# EasyEDA schematic easyeda.json
TITLE: Capacitive Plant Monitor; REV: 1.4; Date: 2020-01-05; Sheet: 1/1; Drawn By: Maciej Miklas; Company: Maciej Miklas
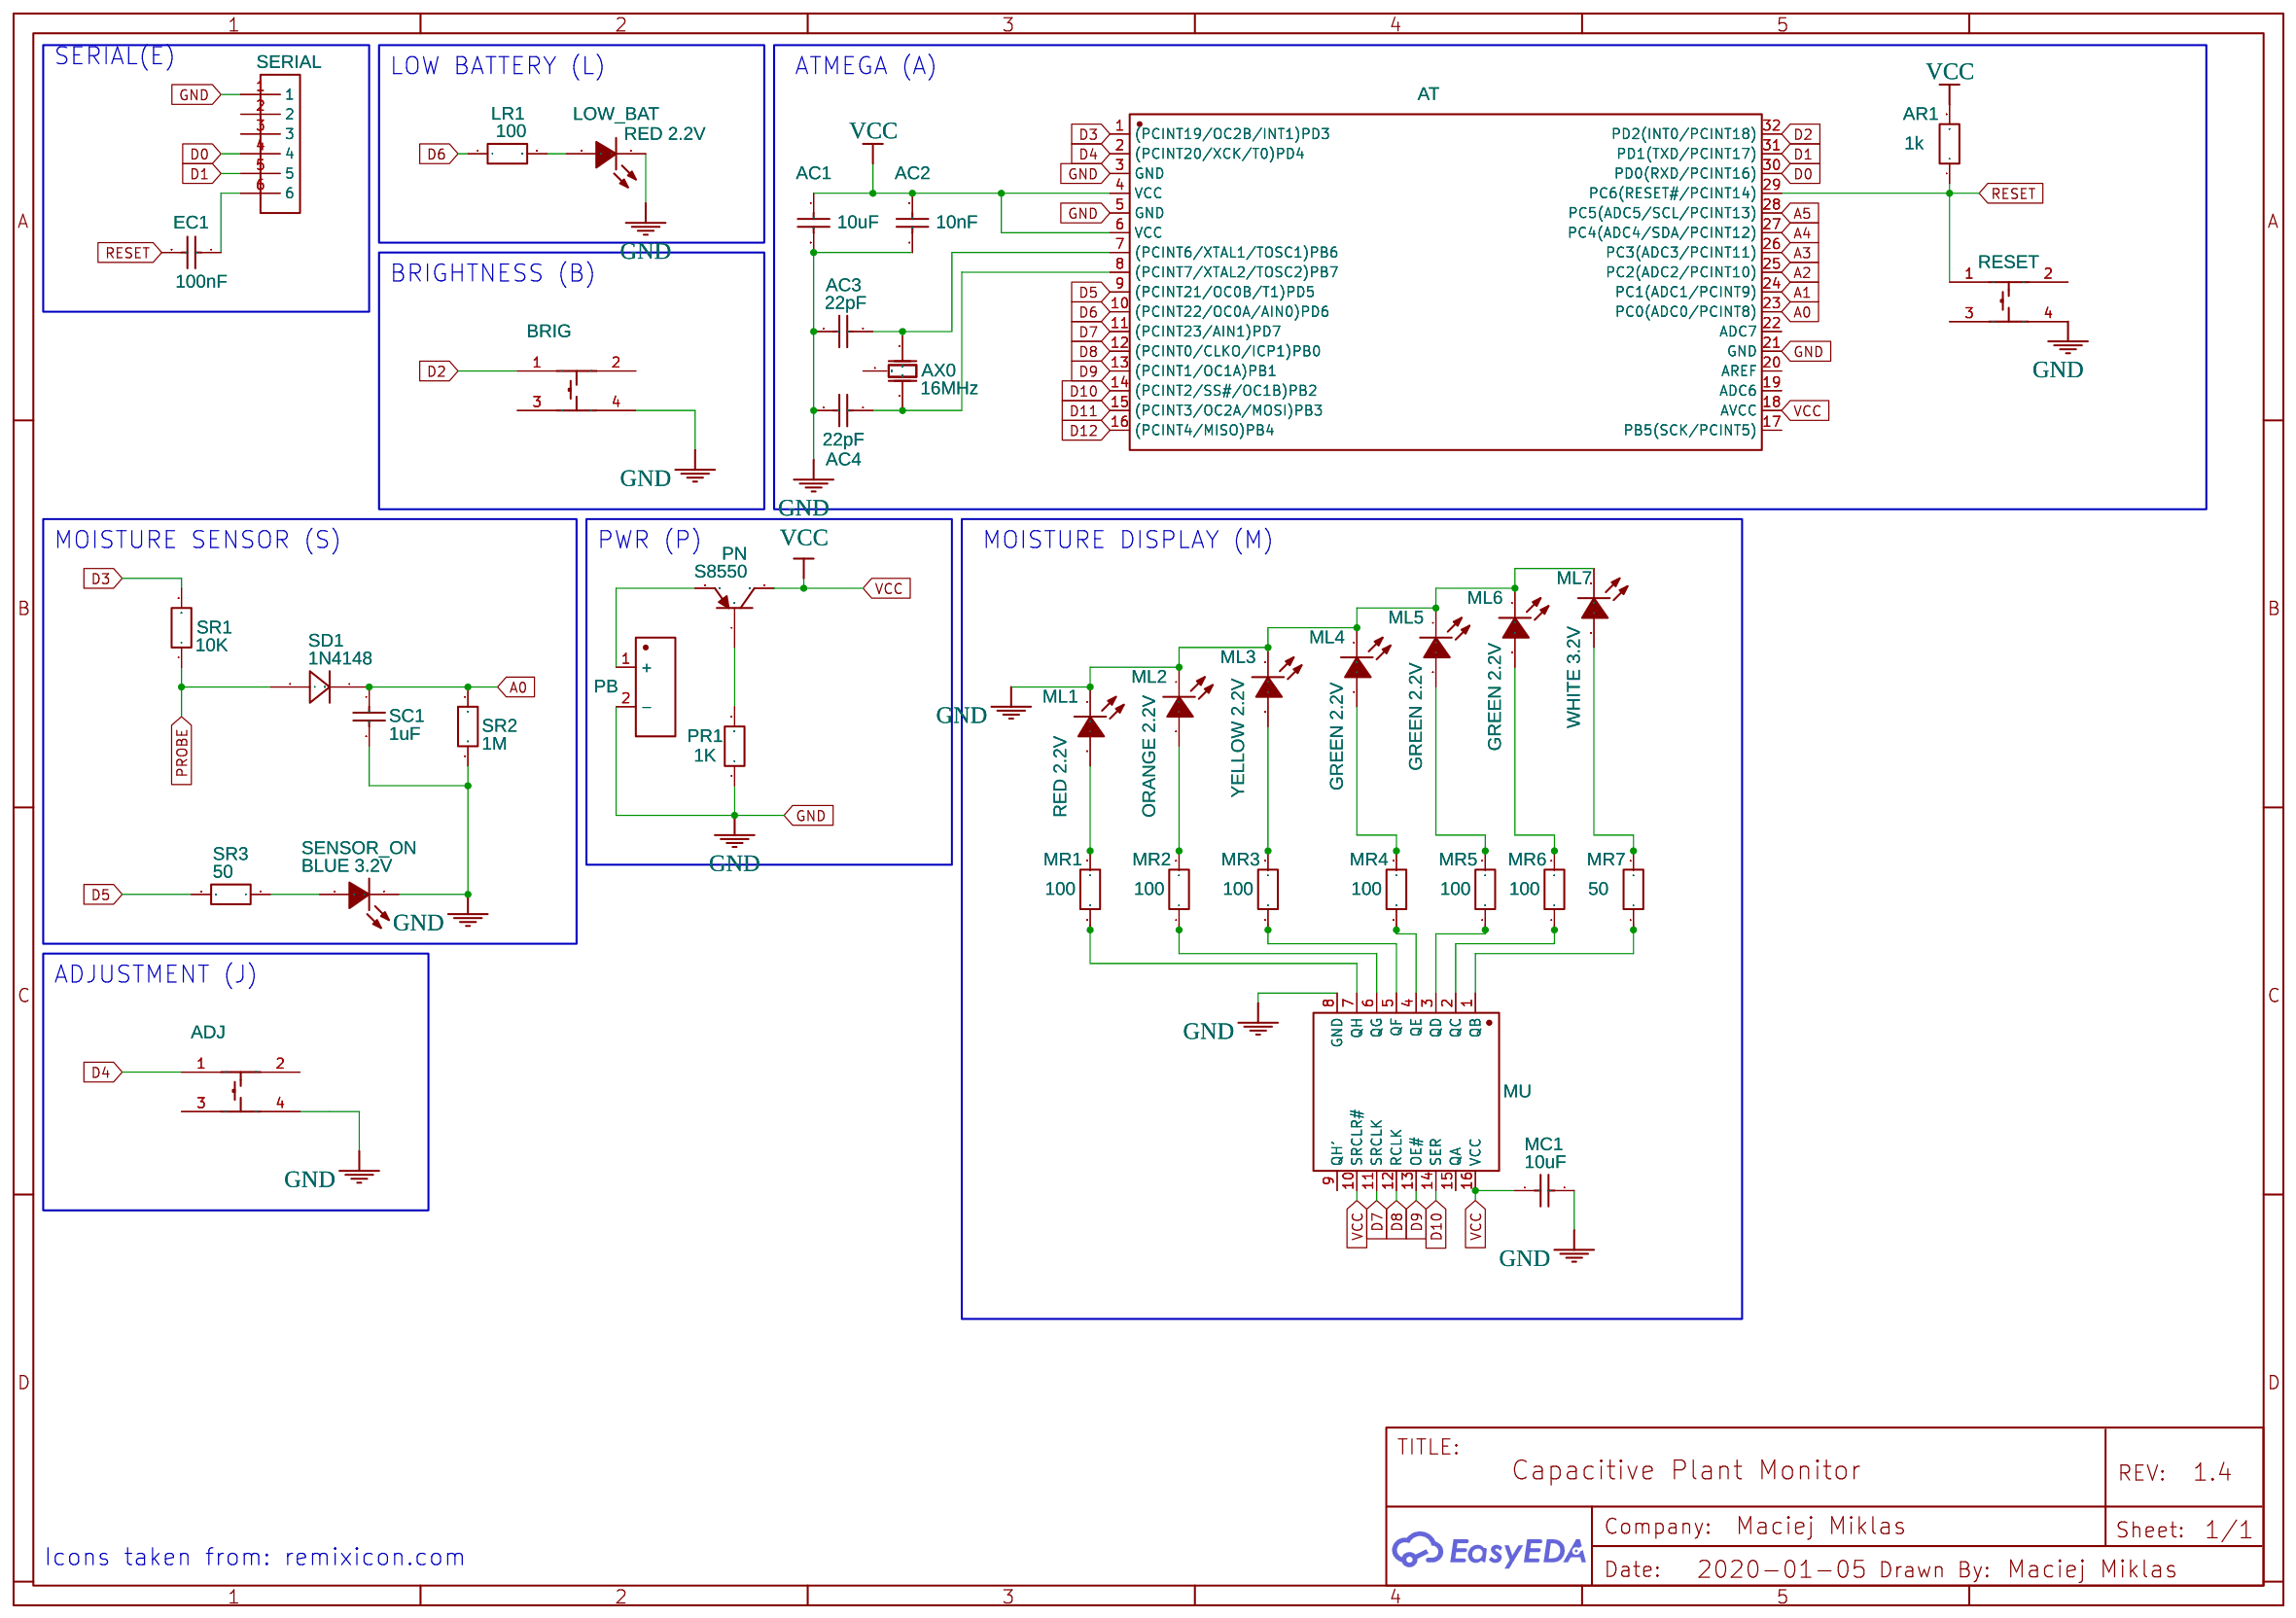
[diagram p0: schematic sheet]

## Parts
AC1  10uF  [C0805]
AC2  10nF  [C0805]
AC3  22pF  [C0805]
AC4  22pF  [C0805]
ADJ  Push Button  [PUSH_BUTTON-SMD_4P]
AR1  1k  [R0805]
AT  ATMEGA328P-AU  [TQFP-32_L7.0-W7.0-P0.80-LS9.0-BL]
AX0  16MHz  [OSC-SMD_3P-L3.2-W1.3-P1.2-L]
BRIG  Push Button  [PUSH_BUTTON-SMD_4P]
EC1  100nF  [C0805]
LOW_BAT  RED 2.2V  [LED0603-RD]
LR1  100  [R0805]
MC1  10uF  [C0805]
ML1  RED 2.2V  [LED0603-RD]
ML2  ORANGE 2.2V  [LED0603-RD]
ML3  YELLOW 2.2V  [LED0603-RD]
ML4  GREEN 2.2V  [LED0603-RD]
ML5  GREEN 2.2V  [LED0603-RD]
ML6  GREEN 2.2V  [LED0603-RD]
ML7  WHITE 3.2V  [LED0603-RD]
MR1  100  [R0805]
MR2  100  [R0805]
MR3  100  [R0805]
MR4  100  [R0805]
MR5  100  [R0805]
MR6  100  [R0805]
MR7  50  [R0805]
MU  CD74HC595M96  [SOIC-16_L10.8-W4.5-P1.27-LS6.8-BL]
PB  ‎BK-18650-PC2‎  [18650_BAT_MM]
PN  S8550  [SOT-23-3_L2.9-W1.3-P1.90-LS2.4-BR]
PR1  1K  [R0805]
RESET  Push Button  [PUSH_BUTTON-SMD_4P]
SC1  1uF  [C0805]
SD1  1N4148  [SOD-123FL_L2.6-W1.6-LS3.4-R-FD]
SENSOR_ON  BLUE 3.2V  [LED0603-RD]
SERIAL  SERIAL  [2.54 6PIN]
SR1  10K  [R0805]
SR2  1M  [R0805]
SR3  50  [R0805]

## Library data of the parts
AC1-AC4 EC1 MC1 SC1 = CC0805KKX7R9BB105: Supplier: LCSC; Manufacturer: YAGEO; Supplier Part: C91185; JLCPCB Part Class: Extended Part
ADJ BRIG RESET = Push Button: Supplier: Office; Contributor: Smart
AR1 LR1 MR1-MR7 PR1 SR1-SR3 = WR08X102 JTL: Supplier: LCSC; Supplier Part: C384174; Manufacturer: Walsin Tech Corp; Contributor: LCSC; Package Display: No
AT = ATMEGA328P-AU: Supplier: LCSC; Manufacturer: MICROCHIP; Supplier Part: C14877; JLCPCB Part Class: Basic Part
AX0 = CSTNE16M0V530000R0: Supplier: LCSC; Supplier Part: C341521; Manufacturer: Murata Electronics; Contributor: LCSC; JLCPCB Part Class: Extended Part
LOW_BAT ML1-ML7 SENSOR_ON = FC-1608YOXK-600H08: Supplier: LCSC; Manufacturer: NATIONSTAR; Contributor: LCSC; Supplier Part: C108553; JLCPCB Part Class: Extended Part
MU = CD74HC595M96: Supplier: LCSC; Manufacturer: TI; Supplier Part: C131977; JLCPCB Part Class: Extended Part
PB = ‎BK-18650-PC2‎: Manufacturer: MPD (Memory Protection Devices); Manufacturer Part: BK-18650-PC2; Supplier: Digi-Key; Supplier Part: BK-18650-PC2-ND; Contributor: crojasq; Package Display: No
PN = S8550_C2828467: Supplier: LCSC; Supplier Part: C2828467; Manufacturer: CBI(创基); Contributor: LCSC
SD1 = 1N4148W-C129216: Supplier: LCSC; Manufacturer: Tak Cheong; Manufacturer Part: 1N4148W; Contributor: LCSC; Supplier Part: C129216; JLCPCB Part Class: Extended Part
SERIAL = 2.54_6PIN: Contributor: fifi1231231

## Nets
GND: AC1.2 AC2.2 AC3.1 AC4.1 ADJ.4 AT.3(GND) AT.5(GND) AT.21(GND) BRIG.4 LOW_BAT.1(K) MC1.2 ML1.1(K) ML2.1(K) ML3.1(K) ML4.1(K) ML5.1(K) ML6.1(K) ML7.1(K) MU.8(GND) PB.2(-) PR1.1 RESET.4 SC1.2 SENSOR_ON.1(K) SERIAL.1 SR2.2
VCC: AC1.1 AC2.1 AR1.2 AT.4(VCC) AT.6(VCC) AT.18(AVCC) MC1.1 MU.10(SRCLR#) MU.16(VCC) PN.3(C)
A0: AT.23(PC0(ADC0/PCINT8)) SC1.1 SD1.1(C) SR2.1
A1: AT.24(PC1(ADC1/PCINT9))
A2: AT.25(PC2(ADC2/PCINT10))
A3: AT.26(PC3(ADC3/PCINT11))
A4: AT.27(PC4(ADC4/SDA/PCINT12))
A5: AT.28(PC5(ADC5/SCL/PCINT13))
D0: AT.30(PD0(RXD/PCINT16)) SERIAL.4
D1: AT.31(PD1(TXD/PCINT17)) SERIAL.5
D2: AT.32(PD2(INT0/PCINT18)) BRIG.1
D3: AT.1((PCINT19/OC2B/INT1)PD3) SR1.2
D4: ADJ.1 AT.2((PCINT20/XCK/T0)PD4)
D5: AT.9((PCINT21/OC0B/T1)PD5) SR3.2
D6: AT.10((PCINT22/OC0A/AIN0)PD6) LR1.1
D7: AT.11((PCINT23/AIN1)PD7) MU.11(SRCLK)
D8: AT.12((PCINT0/CLKO/ICP1)PB0) MU.12(RCLK)
D9: AT.13((PCINT1/OC1A)PB1) MU.13(OE#)
D10: AT.14((PCINT2/SS#/OC1B)PB2) MU.14(SER)
D11: AT.15((PCINT3/OC2A/MOSI)PB3)
D12: AT.16((PCINT4/MISO)PB4)
PROBE: SD1.2(A) SR1.1
RESET: AR1.1 AT.29(PC6(RESET#/PCINT14)) EC1.2 RESET.1
Net-(AC3-2): AC3.2 AT.7((PCINT6/XTAL1/TOSC1)PB6) AX0.3(OSC2)
Net-(AC4-2): AC4.2 AT.8((PCINT7/XTAL2/TOSC2)PB7) AX0.1(OSC1)
Net-(EC1-1): EC1.1 SERIAL.6
Net-(LOW_BAT-2): LOW_BAT.2(A) LR1.2
Net-(ML1-2): ML1.2(A) MR1.2
Net-(ML2-2): ML2.2(A) MR2.2
Net-(ML3-2): ML3.2(A) MR3.2
Net-(ML4-2): ML4.2(A) MR4.2
Net-(ML5-2): ML5.2(A) MR5.2
Net-(ML6-2): ML6.2(A) MR6.2
Net-(ML7-2): ML7.2(A) MR7.2
Net-(MR1-1): MR1.1 MU.7(QH)
Net-(MR2-1): MR2.1 MU.6(QG)
Net-(MR3-1): MR3.1 MU.5(QF)
Net-(MR4-1): MR4.1 MU.4(QE)
Net-(MR5-1): MR5.1 MU.3(QD)
Net-(MR6-1): MR6.1 MU.2(QC)
Net-(MR7-1): MR7.1 MU.1(QB)
Net-(PB-1): PB.1(+) PN.2(E)
Net-(PN-1): PN.1(B) PR1.2
Net-(SENSOR_ON-2): SENSOR_ON.2(A) SR3.1

Not connected (* = marked no-connect by the designer): ADJ 2 3; AT 17(PB5(SCK/PCINT5)) 19(ADC6) 20(AREF) 22(ADC7); AX0 2(GND); BRIG 2 3; MU 9(QH’) 15(QA); RESET 2 3; SERIAL 2 3

## Notes on the sheet
- SERIAL(E)
- LOW BATTERY (L)
- ATMEGA (A)
- BRIGHTNESS (B)
- MOISTURE SENSOR (S)
- PWR (P)
- MOISTURE DISPLAY (M)
- ADJUSTMENT (J)
- Icons taken from: remixicon.com
